# Altium schematic sheet Connector.SchDoc
size A
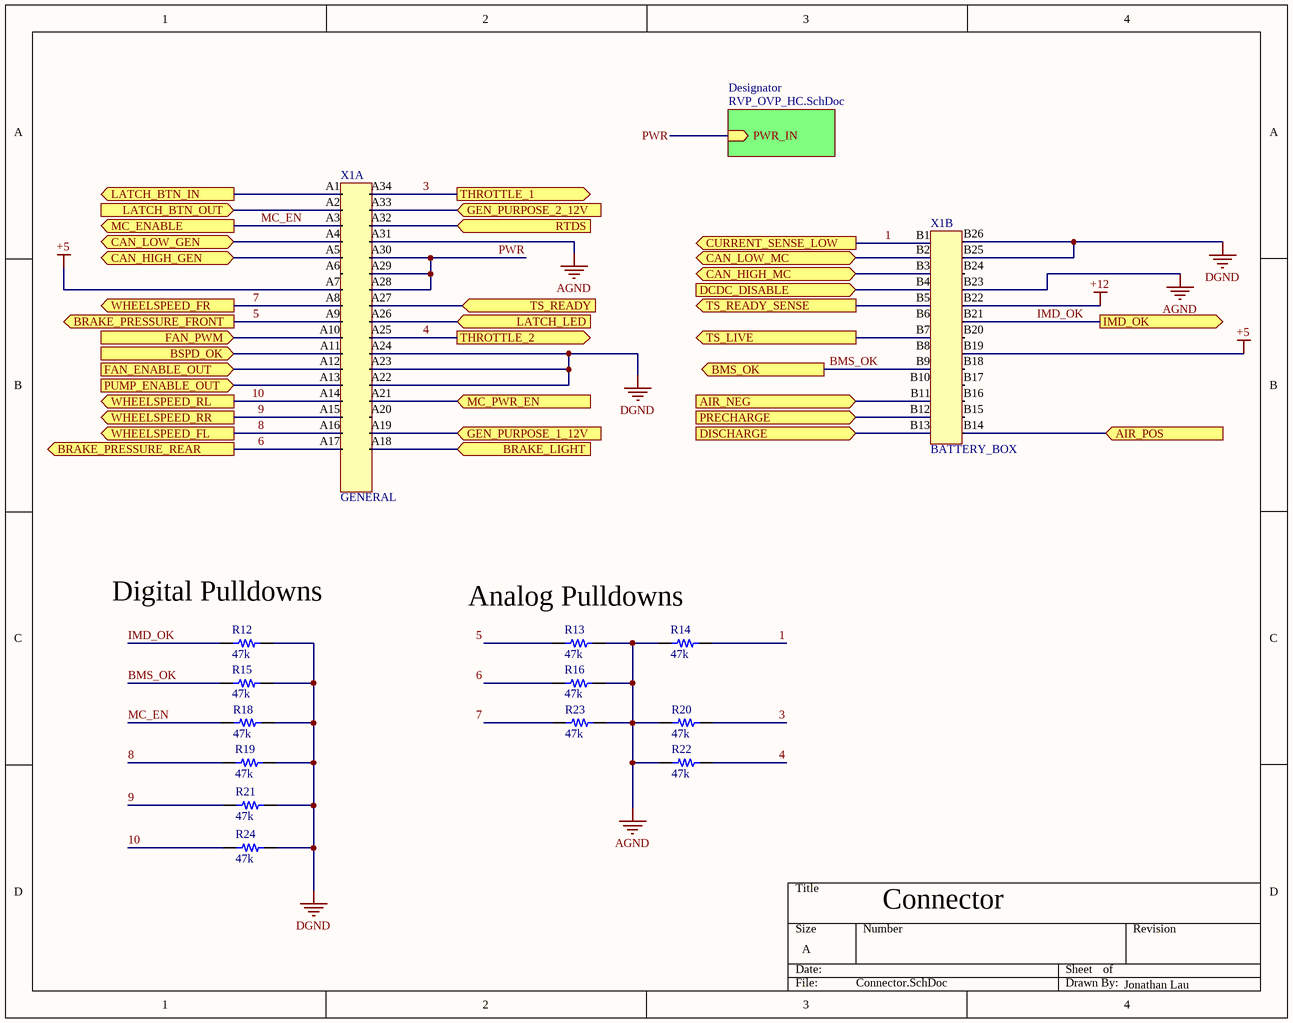
[diagram p0: Connector.SchDoc]

## Parts
R12  value 47k  [RES 0805/2012]  (hidden comment: Resistor 47k 0805 1/10W 1%)
R13  value 47k  [RES 0805/2012]  (hidden comment: Resistor 47k 0805 1/10W 5%)
R14  value 47k  [RES 0805/2012]  (hidden comment: Resistor 47k 0805 1/10W 5%)
R15  value 47k  [RES 0805/2012]  (hidden comment: Resistor 47k 0805 1/10W 1%)
R16  value 47k  [RES 0805/2012]  (hidden comment: Resistor 47k 0805 1/10W 5%)
R18  value 47k  [RES 0805/2012]  (hidden comment: Resistor 47k 0805 1/10W 1%)
R19  value 47k  [RES 0805/2012]  (hidden comment: Resistor 47k 0805 1/10W 5%)
R20  value 47k  [RES 0805/2012]  (hidden comment: Resistor 47k 0805 1/10W 5%)
R21  value 47k  [RES 0805/2012]  (hidden comment: Resistor 47k 0805 1/10W 5%)
R22  value 47k  [RES 0805/2012]  (hidden comment: Resistor 47k 0805 1/10W 5%)
R23  value 47k  [RES 0805/2012]  (hidden comment: Resistor 47k 0805 1/10W 5%)
R24  value 47k  [RES 0805/2012]  (hidden comment: Resistor 47k 0805 1/10W 5%)
X1  GENERAL  [SUPERSEAL 60POS 90Deg]  (parts A,B of 2)

## Sub-sheets
Designator = RVP_OVP_HC.SchDoc: PWR_IN (in)

## Ports
AIR_NEG (in), AIR_POS (in), BMS_OK (out), BRAKE_LIGHT (in), BRAKE_PRESSURE_FRONT (out), BRAKE_PRESSURE_REAR (out), BSPD_OK (in), CAN_HIGH_GEN (bidir), CAN_HIGH_MC (bidir), CAN_LOW_GEN (bidir), CAN_LOW_MC (bidir), CURRENT_SENSE_LOW (out), DCDC_DISABLE (in), DISCHARGE (in), FAN_ENABLE_OUT (in), FAN_PWM (in), GEN_PURPOSE_1_12V (in), GEN_PURPOSE_2_12V (in), IMD_OK (out), LATCH_BTN_IN (out), LATCH_BTN_OUT (in), LATCH_LED (in), MC_ENABLE (out), MC_PWR_EN (in), PRECHARGE (in), PUMP_ENABLE_OUT (in), RTDS (in), THROTTLE_1 (out), THROTTLE_2 (out), TS_LIVE (out), TS_READY (in), TS_READY_SENSE (out), WHEELSPEED_FL (out), WHEELSPEED_FR (out), WHEELSPEED_RL (out), WHEELSPEED_RR (out)

## Nets
+5: X1.A7 X1.B19
+12: X1.B22
AGND: R13.2 R14.1 R16.2 R20.1 R22.1 R23.2 X1.A31 X1.B23
DGND: R12.2 R15.2 R18.2 R19.2 R21.2 R24.2 X1.A22 X1.A23 X1.A24 X1.B25 X1.B26
1: R14.2 X1.B1 ; port CURRENT_SENSE_LOW
3: R20.2 X1.A34 ; port THROTTLE_1
4: R22.2 X1.A25 ; port THROTTLE_2
5: R13.1 X1.A9 ; port BRAKE_PRESSURE_FRONT
6: R16.1 X1.A17 ; port BRAKE_PRESSURE_REAR
7: R23.1 X1.A8 ; port WHEELSPEED_FR
8: R19.1 X1.A16 ; port WHEELSPEED_FL
9: R21.1 X1.A15 ; port WHEELSPEED_RR
10: R24.1 X1.A14 ; port WHEELSPEED_RL
AIR_NEG: X1.B11 ; port AIR_NEG
AIR_POS: X1.B14 ; port AIR_POS
BMS_OK: R15.1 X1.B9 ; port BMS_OK
BRAKE_LIGHT: X1.A18 ; port BRAKE_LIGHT
BSPD_OK: X1.A11 ; port BSPD_OK
CAN_HIGH_GEN: X1.A5 ; port CAN_HIGH_GEN
CAN_HIGH_MC: X1.B3 ; port CAN_HIGH_MC
CAN_LOW_GEN: X1.A4 ; port CAN_LOW_GEN
CAN_LOW_MC: X1.B2 ; port CAN_LOW_MC
DCDC_DISABLE: X1.B4 ; port DCDC_DISABLE
DISCHARGE: X1.B13 ; port DISCHARGE
FAN_ENABLE_OUT: X1.A12 ; port FAN_ENABLE_OUT
FAN_PWM: X1.A10 ; port FAN_PWM
GEN_PURPOSE_1_12V: X1.A19 ; port GEN_PURPOSE_1_12V
GEN_PURPOSE_2_12V: X1.A33 ; port GEN_PURPOSE_2_12V
IMD_OK: R12.1 X1.B21 ; port IMD_OK
LATCH_BTN_IN: X1.A1 ; port LATCH_BTN_IN
LATCH_BTN_OUT: X1.A2 ; port LATCH_BTN_OUT
LATCH_LED: X1.A26 ; port LATCH_LED
MC_EN: R18.1 X1.A3 ; port MC_ENABLE
MC_PWR_EN: X1.A21 ; port MC_PWR_EN
PRECHARGE: X1.B12 ; port PRECHARGE
PUMP_ENABLE_OUT: X1.A13 ; port PUMP_ENABLE_OUT
PWR: X1.A28 X1.A29 X1.A30 ; sheet Designator/PWR_IN
RTDS: X1.A32 ; port RTDS
TS_LIVE: X1.B7 ; port TS_LIVE
TS_READY: X1.A27 ; port TS_READY
TS_READY_SENSE: X1.B5 ; port TS_READY_SENSE

Not connected (* = marked no-connect by the designer): X1 A6 A20 B6 B8 B10 B15 B16 B17 B18 B20 B24

## Notes on the sheet
- (near R12) Digital Pulldowns
- Analog Pulldowns
- Connector
- Jonathan Lau

## Library data of the parts
R12 R15 R18 = 545: Manufacturer_id: 1; idResistor: 545; Name: Res_47k_0805_1/10W_1%; Created_By: Nick Mah; Supplier 1: Digi-Key; Drawer_id: 1; Tolerance: 1%; Power: 1/10W; Package: 0805; ComponentLink1Description: Datasheet; Created_Date: 2018-10-20
R13 R14 R16 R19-R24 = 1625: Manufacturer_id: 1; idResistor: 1625; Name: Res_47k_0805_1/10W_5%; Created_By: Nick Mah; Supplier 1: Digi-Key; Drawer_id: 1; Tolerance: 5%; Power: 1/10W; Package: 0805; ComponentLink1Description: Datasheet; Created_Date: 2018-10-20
X1 = 3: 90 Degree; MfrPartNo: 3-6437285-2; Manufacturer_id: 1; idConn: 3; Name: AMP Superseal 60POS 90Deg; Value: CONN; Num_Contacts: 60; Num_Rows: 4; Pitch: 3 mm; Drawer_id: 1; Link: https://www.te.com/usa-en/product-3-6437285-2.html; ComponentLink1Description: Datasheet